# Altium schematic sheet 0_architecture.schdoc: OBDH Hardware Archictecture
size A4; Revision: v0.7; SheetNumber: 0; SheetTotal: 6; ProjectCode: obdh2; Designed by: André M. P. Mattos; Version: v0.7
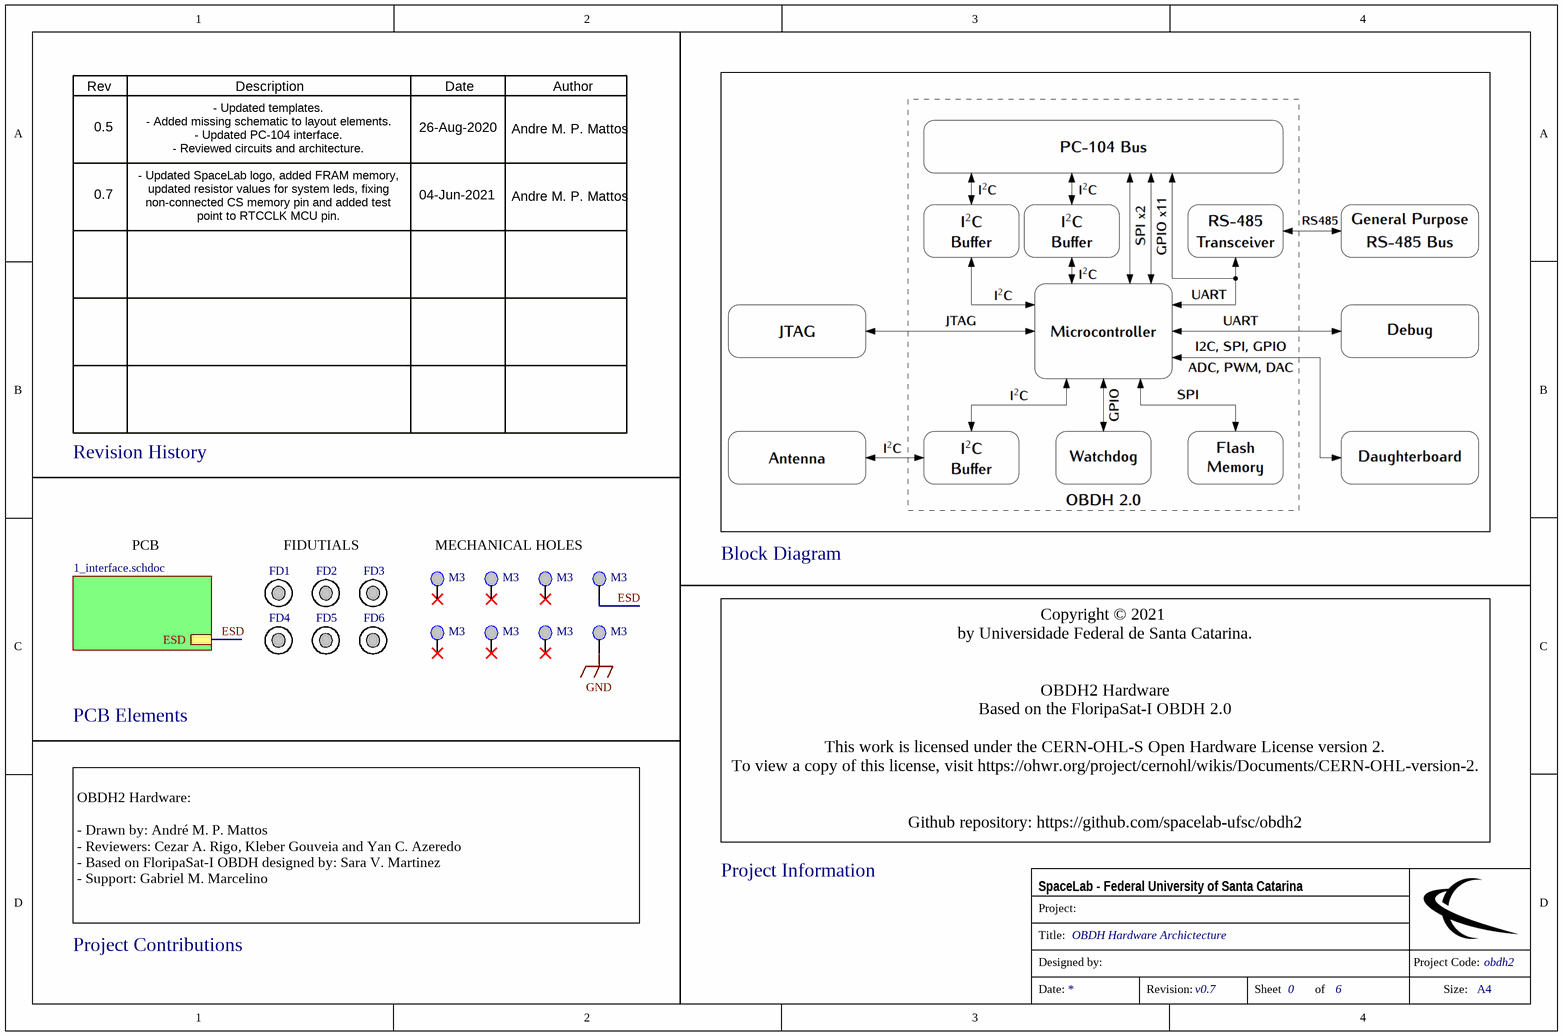
[diagram p0: 0_architecture.schdoc]

## Parts
FD1  Fiducial 1.3  [Fiducial 1.3mm]  (value not drawn)  (no BOM)
FD2  Fiducial 1.3  [Fiducial 1.3mm]  (value not drawn)  (no BOM)
FD3  Fiducial 1.3  [Fiducial 1.3mm]  (value not drawn)  (no BOM)
FD4  Fiducial 1.3  [Fiducial 1.3mm]  (value not drawn)  (no BOM)
FD5  Fiducial 1.3  [Fiducial 1.3mm]  (value not drawn)  (no BOM)
FD6  Fiducial 1.3  [Fiducial 1.3mm]  (value not drawn)  (no BOM)
MEC1  M3  [M3 hole]  (no BOM)
MEC2  M3  [M3 hole]  (no BOM)
MEC3  M3  [M3 hole]  (no BOM)
MEC4  M3  [M3 hole]  (no BOM)
MEC5  M3  [M3 hole]  (no BOM)
MEC6  M3  [M3 hole]  (no BOM)
MEC7  M3  [M3 hole]  (no BOM)
MEC8  M3  [M3 hole]  (no BOM)

## Sub-sheets
Interface = 1_interface.schdoc: ESD

## Nets
GND: MEC8.0
ESD: MEC4.0 ; sheet Interface/ESD

Not connected (* = marked no-connect by the designer): MEC1 0*; MEC2 0*; MEC3 0*; MEC5 0*; MEC6 0*; MEC7 0*

## Notes on the sheet
- Rev
- Description
- Date
- Author
- 0.5
- - Updated templates.
  - Added missing schematic to layout elements.
  - Updated PC-104 interface.
  - Reviewed circuits and architecture.
- 26-Aug-2020
- Andre M. P. Mattos
- 0.7
- - Updated SpaceLab logo, added FRAM memory, updated resistor values for system leds, fixing non-connected CS memory pin and added test point to RTCCLK MCU pin.
- 04-Jun-2021
- Revision History
- PCB
- FIDUTIALS
- MECHANICAL HOLES
- Block Diagram
- PCB Elements
- Copyright © 2021
  by Universidade Federal de Santa Catarina.
  OBDH2 Hardware
  Based on the FloripaSat-I OBDH 2.0
  This work is licensed under the CERN-OHL-S Open Hardware License version 2.
  To view a copy of this license, visit https://ohwr.org/project/cernohl/wikis/Documents/CERN-OHL-version-2.
  Github repository: https://github.com/spacelab-ufsc/obdh2
  More info about SpaceLab: https://spacelab.ufsc.br/
- OBDH2 Hardware:
  - Drawn by: André M. P. Mattos
  - Reviewers: Cezar A. Rigo, Kleber Gouveia and Yan C. Azeredo
  - Based on FloripaSat-I OBDH designed by: Sara V. Martinez
  - Support: Gabriel M. Marcelino
- Project Information
- Project Contributions
- Project:
- SpaceLab - Federal University of Santa Catarina
- Title:
- Designed by:
- Project Code:
- Date:
- Revision:
- Sheet
- of
- Size:
- A4

## Library data of the parts
FD1-FD6 = Fiducial 1.3: Fiducial 1.3mm
MEC1-MEC8 = M3 hole